# EAGLE schematic rotary-encoder-breakout-mk-2.0 (EAGLE 7.5.0)
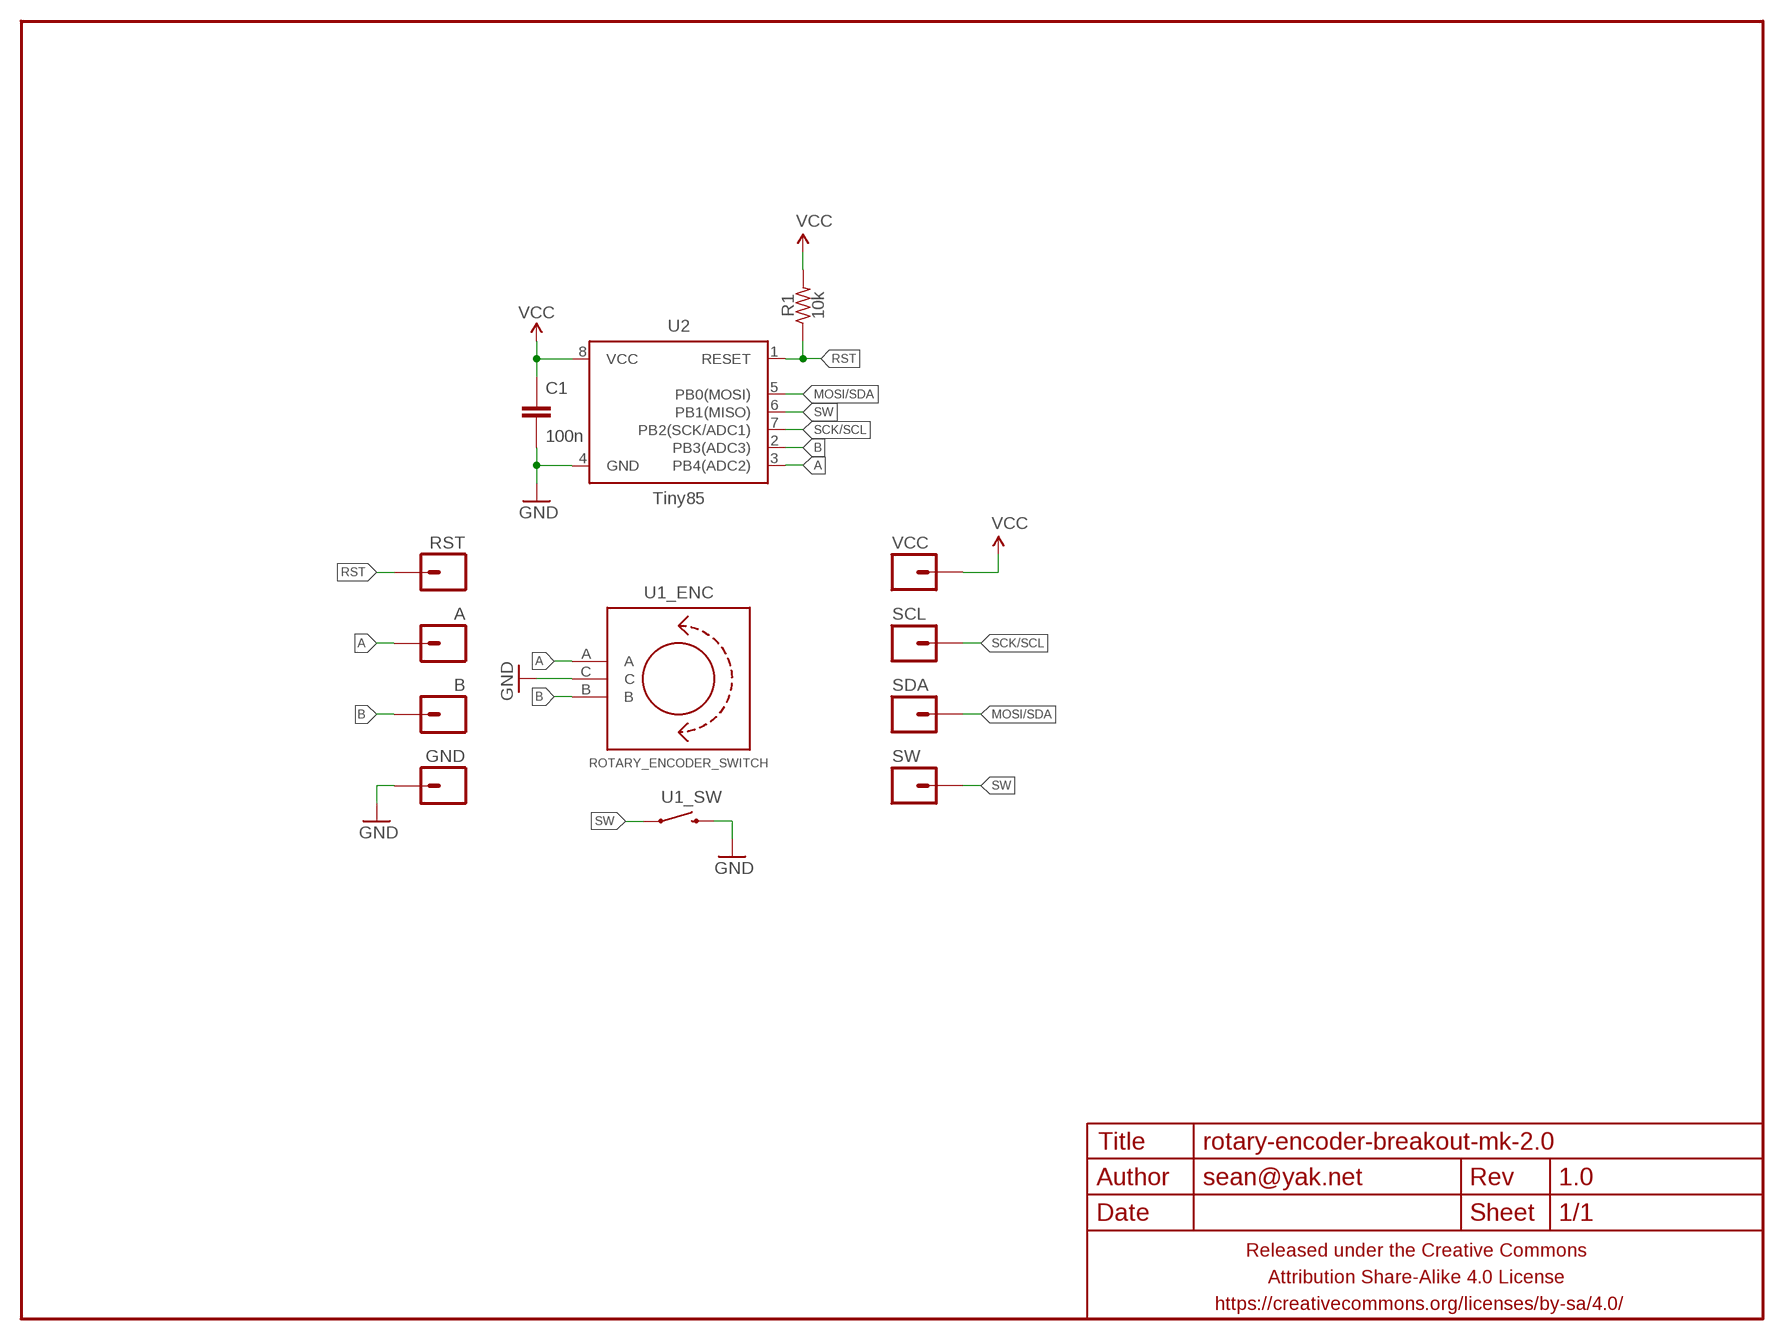
[diagram p0: schematic, sheet 1]

## Parts
A  M01PTH-1MM  [1X01-1MM-NS]
B  M01PTH-1MM  [1X01-1MM-NS]
C1  100n  CAPACITOR-CERAMICC0603-TIGHTER  [C0603-TIGHTER]
FRAME1  FRAME-LETTERNO_PACKAGE  [DUMMY]
GND  M01PTH-1MM  [1X01-1MM-NS]
R1  10k  RESISTORR0603-TIGHTER  [R0603-TIGHTER]
RST  M01PTH-1MM  [1X01-1MM-NS]
SCL  M01PTH-1MM  [1X01-1MM-NS]
SDA  M01PTH-1MM  [1X01-1MM-NS]
SW  M01PTH-1MM  [1X01-1MM-NS]
U1_  ROTARY_ENCODER_SWITCH  [ROTARY_ENCODER_SWITCH]
U2  Tiny85  ATTINY45TINY85-20-SOICW  [SO08-EIAJ]
VCC  M01PTH-1MM  [1X01-1MM-NS]

## Nets
A: A.1 U1_.A(ENC:A) U2.3(PB4(ADC2))
B: B.1 U1_.B(ENC:B) U2.2(PB3(ADC3))
GND: C1.2 GND.1 U1_.C(ENC:C) U1_.SW2 U2.4(GND)
MOSI/SDA: SDA.1 U2.5(PB0(MOSI))
RST: R1.1 RST.1 U2.1(RESET)
SCK/SCL: SCL.1 U2.7(PB2(SCK/ADC1))
SW: SW.1 U1_.SW1 U2.6(PB1(MISO))
VCC: C1.1 R1.2 U2.8(VCC) VCC.1

## Library data of the parts
A B GND RST SCL SDA SW VCC = a_parts:M01: Header 1 Standard 1-pin 0.1" header. Use with straight break away headers (SKU : PRT-00116), right angle break away headers (PRT-00553), swiss pins (PRT-00743), machine pins (PRT-00117), and female headers (PRT-00115).
C1 = a_parts:CAPACITOR-CERAMIC: CAPACITOR, European symbol
FRAME1 = A_butts:FRAME-LETTER: Schematic Frame Standard 8.5x11 US Letter frame; DESIGNER: sean@yak.net; VERSION: 1.0
R1 = a_parts:RESISTOR: RESISTOR, American symbol
U1_ = a_parts:ROTARY_ENCODER_SWITCH
U2 = a_parts:ATTINY45: Atmel 8-pin 2/4/8kB flash uC; PROD_ID: IC-09092; VALUE: Tiny85-20-SMT